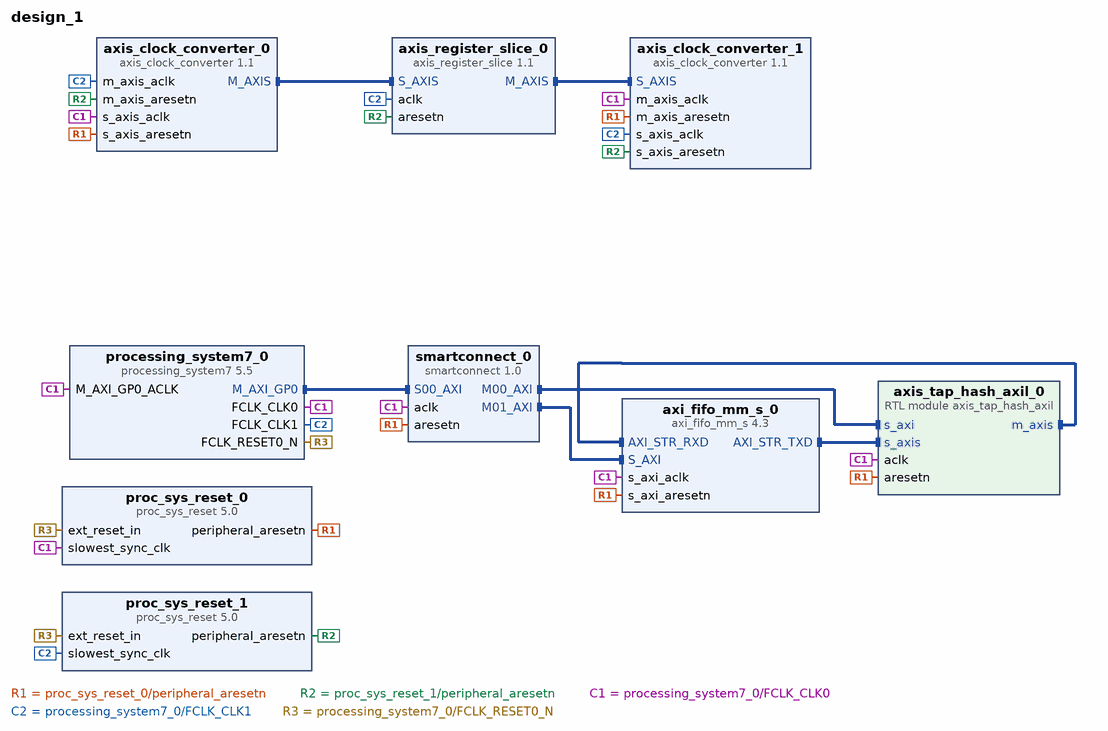
[diagram p0: block diagram of the top level]
# Vivado block design design_1, xc7z015clg485-2, Vivado 2025.1
create_bd_design design_1

create_bd_cell -type ip -vlnv xilinx.com:ip:processing_system7:5.5 processing_system7_0
set_property -dict [list \
  CONFIG.PCW_EN_CLK1_PORT 1 \
  CONFIG.PCW_FPGA0_PERIPHERAL_FREQMHZ 100 \
  CONFIG.PCW_FPGA1_PERIPHERAL_FREQMHZ 125 \
  CONFIG.PCW_FPGA_FCLK1_ENABLE 1 \
] [get_bd_cells processing_system7_0]
# 31 more settings of processing_system7_0 are not shown: defaults, MIO pin electricals, DDR timing, and values the tool derives
create_bd_cell -type ip -vlnv xilinx.com:ip:proc_sys_reset:5.0 proc_sys_reset_0
create_bd_cell -type ip -vlnv xilinx.com:ip:smartconnect:1.0 smartconnect_0
set_property -dict {CONFIG.NUM_MI 2 CONFIG.NUM_SI 1} [get_bd_cells smartconnect_0]
create_bd_cell -type ip -vlnv xilinx.com:ip:axi_fifo_mm_s:4.3 axi_fifo_mm_s_0
set_property -dict {CONFIG.C_DATA_INTERFACE_TYPE 0 CONFIG.C_USE_TX_CTRL 0} [get_bd_cells axi_fifo_mm_s_0]
create_bd_cell -type ip -vlnv xilinx.com:ip:axis_register_slice:1.1 axis_register_slice_0
create_bd_cell -type ip -vlnv xilinx.com:ip:proc_sys_reset:5.0 proc_sys_reset_1
create_bd_cell -type ip -vlnv xilinx.com:ip:axis_clock_converter:1.1 axis_clock_converter_0
set_property -dict {CONFIG.HAS_TLAST 1 CONFIG.TDATA_NUM_BYTES 4} [get_bd_cells axis_clock_converter_0]
create_bd_cell -type ip -vlnv xilinx.com:ip:axis_clock_converter:1.1 axis_clock_converter_1
set_property -dict {CONFIG.HAS_TLAST 1 CONFIG.TDATA_NUM_BYTES 4} [get_bd_cells axis_clock_converter_1]
create_bd_cell -type module -reference axis_tap_hash_axil axis_tap_hash_axil_0

# ---- connections ----

connect_bd_intf_net [get_bd_intf_pins axi_fifo_mm_s_0/AXI_STR_TXD] [get_bd_intf_pins axis_tap_hash_axil_0/s_axis]
connect_bd_intf_net [get_bd_intf_pins axis_clock_converter_0/M_AXIS] [get_bd_intf_pins axis_register_slice_0/S_AXIS]
connect_bd_intf_net [get_bd_intf_pins axis_register_slice_0/M_AXIS] [get_bd_intf_pins axis_clock_converter_1/S_AXIS]
connect_bd_intf_net [get_bd_intf_pins axis_tap_hash_axil_0/m_axis] [get_bd_intf_pins axi_fifo_mm_s_0/AXI_STR_RXD]
connect_bd_intf_net [get_bd_intf_pins processing_system7_0/M_AXI_GP0] [get_bd_intf_pins smartconnect_0/S00_AXI]
connect_bd_intf_net [get_bd_intf_pins smartconnect_0/M00_AXI] [get_bd_intf_pins axis_tap_hash_axil_0/s_axi]
connect_bd_intf_net [get_bd_intf_pins smartconnect_0/M01_AXI] [get_bd_intf_pins axi_fifo_mm_s_0/S_AXI]
connect_bd_net [get_bd_pins proc_sys_reset_0/peripheral_aresetn] \
  [get_bd_pins axi_fifo_mm_s_0/s_axi_aresetn] [get_bd_pins smartconnect_0/aresetn] \
  [get_bd_pins axis_clock_converter_0/s_axis_aresetn] [get_bd_pins axis_clock_converter_1/m_axis_aresetn] \
  [get_bd_pins axis_tap_hash_axil_0/aresetn]
connect_bd_net [get_bd_pins proc_sys_reset_1/peripheral_aresetn] \
  [get_bd_pins axis_clock_converter_0/m_axis_aresetn] [get_bd_pins axis_clock_converter_1/s_axis_aresetn] \
  [get_bd_pins axis_register_slice_0/aresetn]
connect_bd_net [get_bd_pins processing_system7_0/FCLK_CLK0] \
  [get_bd_pins processing_system7_0/M_AXI_GP0_ACLK] [get_bd_pins proc_sys_reset_0/slowest_sync_clk] \
  [get_bd_pins smartconnect_0/aclk] [get_bd_pins axi_fifo_mm_s_0/s_axi_aclk] [get_bd_pins axis_clock_converter_0/s_axis_aclk] \
  [get_bd_pins axis_clock_converter_1/m_axis_aclk] [get_bd_pins axis_tap_hash_axil_0/aclk]
connect_bd_net [get_bd_pins processing_system7_0/FCLK_CLK1] \
  [get_bd_pins proc_sys_reset_1/slowest_sync_clk] [get_bd_pins axis_clock_converter_0/m_axis_aclk] \
  [get_bd_pins axis_clock_converter_1/s_axis_aclk] [get_bd_pins axis_register_slice_0/aclk]
connect_bd_net [get_bd_pins processing_system7_0/FCLK_RESET0_N] \
  [get_bd_pins proc_sys_reset_0/ext_reset_in] [get_bd_pins proc_sys_reset_1/ext_reset_in]

# ---- address map ----
assign_bd_address -offset 0x40000000 -range 4K -target_address_space [get_bd_addr_spaces processing_system7_0/Data] [get_bd_addr_segs axis_tap_hash_axil_0/s_axi/reg0]
assign_bd_address -offset 0x43C00000 -range 64K -target_address_space [get_bd_addr_spaces processing_system7_0/Data] [get_bd_addr_segs axi_fifo_mm_s_0/S_AXI/Mem0]

validate_bd_design
save_bd_design
